# Altium schematic sheet base.SchDoc
size A4; SheetNumber: 1; SheetTotal: 1
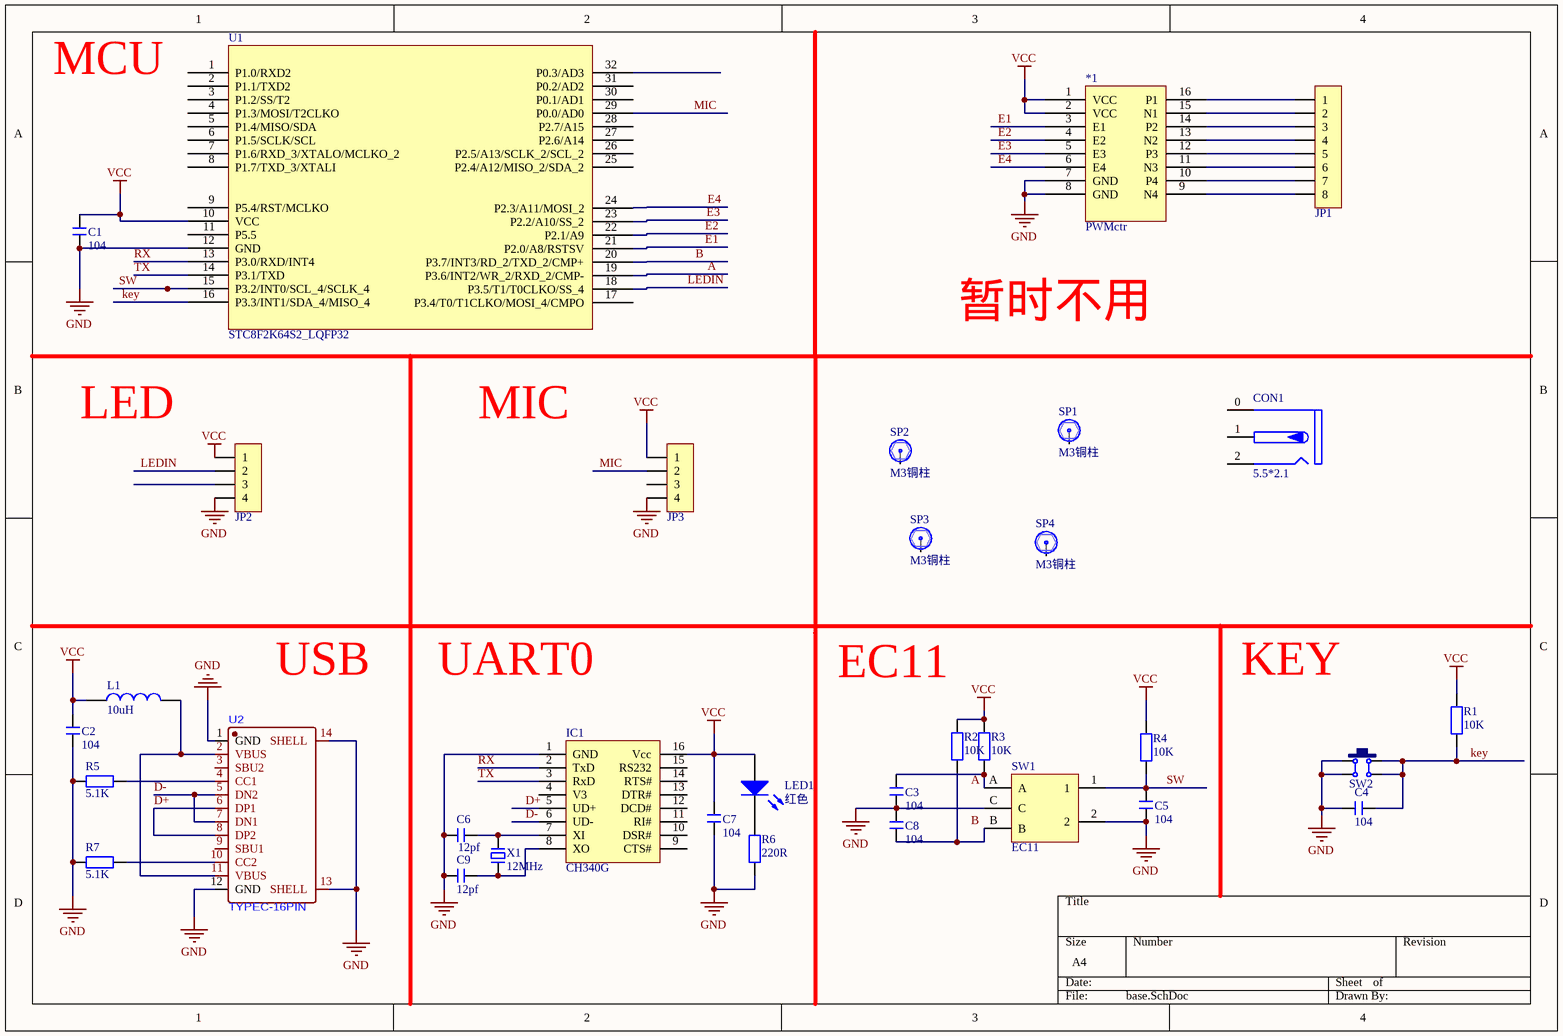
[diagram p0: base.SchDoc]

## Parts
*1  PWMctr  [PWMctr]
C1  104  [C 0805_L]
C2  104  [C 0805_L]
C3  104  [C 0805_L]
C4  104  [C 0805_L]
C5  104  [C 0805_L]
C6  12pf  [C 0805_L]
C7  104  [C 0805_L]
C8  104  [C 0805_L]
C9  12pf  [C 0805_L]
CON1  5.5*2.1  [DC-005P]
IC1  CH340G  [SOP16_L]
JP1  HDR-1X8  [XH2.54-WI-8P]  (value not drawn)
JP2  HDR-1X4  [XH2.54-WI-4P]  (value not drawn)
JP3  HDR-1X4  [XH2.54-WI-4P]  (value not drawn)
L1  10uH  [L 1206]
LED1  红色  [LED 3MM-B]
R1  10K  [R 0805_L]
R2  10K  [R 0805_L]
R3  10K  [R 0805_L]
R4  10K  [R 0805_L]
R5  5.1K  [R 0805_L]
R6  220R  [R 0805_L]
R7  5.1K  [R 0805_L]
SP1  M3铜柱  [M3x4+6_N]
SP2  M3铜柱  [M3x4+6_N]
SP3  M3铜柱  [M3x4+6_N]
SP4  M3铜柱  [M3x4+6_N]
SW1  EC11  [EC11]
SW2  12x12x5  [TSW DIP-12*12*12]  (value not drawn)
U1  STC8F2K64S2_LQFP32  [MCU]
U2  TYPEC-16PIN  [USB-C-16pin]
X1  12MHz  [OSC HC-49S]

## Nets
GND: *1.7(GND) *1.8(GND) C1.1 C2.1 C3.2 C4.1 C5.2 C6.2 C7.2 C8.1 C9.2 IC1.1(GND) JP2.4 JP3.4 R5.2 R6.2 R7.2 SW1.2 SW1.C SW2.1 SW2.4 U1.12(GND) U2.1(GND) U2.12(GND) U2.13(SHELL) U2.14(SHELL)
VCC: *1.1(VCC) *1.2(VCC) C1.2 C2.2 C7.1 IC1.16(Vcc) JP2.1 JP3.1 L1.1 LED1.1(A) R1.1 R2.1 R3.1 R4.1 U1.10(VCC)
A: U1.19(P3.6/INT2/WR_2/RXD_2/CMP-)
B: U1.20(P3.7/INT3/RD_2/TXD_2/CMP+)
D+: IC1.5(UD+) U2.6(DP1) U2.8(DP2)
D-: IC1.6(UD-) U2.5(DN2) U2.7(DN1)
E1: *1.3(E1) U1.21(P2.0/A8/RSTSV)
E2: *1.4(E2) U1.22(P2.1/A9)
E3: *1.5(E3) U1.23(P2.2/A10/SS_2)
E4: *1.6(E4) U1.24(P2.3/A11/MOSI_2)
key: C4.2 R1.2 SW2.2 SW2.3 U1.16(P3.3/INT1/SDA_4/MISO_4)
LEDIN: JP2.2 U1.18(P3.5/T1/T0CLKO/SS_4)
MIC: JP3.2 U1.29(P0.0/AD0)
RX: IC1.2(TxD) U1.13(P3.0/RXD/INT4)
SW: C5.1 R4.2 SW1.1 U1.15(P3.2/INT0/SCL_4/SCLK_4)
TX: IC1.3(RxD) U1.14(P3.1/TXD)
Net*1_9: *1.9(N4) JP1.8
Net*1_10: *1.10(P4) JP1.7
Net*1_11: *1.11(N3) JP1.6
Net*1_12: *1.12(P3) JP1.5
Net*1_13: *1.13(N2) JP1.4
Net*1_14: *1.14(P2) JP1.3
Net*1_15: *1.15(N1) JP1.2
Net*1_16: *1.16(P1) JP1.1
NetC3_1: C3.1 R3.2 SW1.A
NetC6_1: C6.1 IC1.7(XI) X1.1
NetC8_2: C8.2 R2.2 SW1.B
NetC9_1: C9.1 IC1.8(XO) X1.2
NetL1_2: L1.2 U2.2(VBUS) U2.11(VBUS)
NetLED1_2: LED1.2(K) R6.1
NetR5_1: R5.1 U2.4(CC1)
NetR7_1: R7.1 U2.10(CC2)

Not connected (* = marked no-connect by the designer): CON1 0 1 2; IC1 4(V3) 9(CTS#) 10(DSR#) 11(RI#) 12(DCD#) 13(DTR#) 14(RTS#) 15(RS232); JP2 3; JP3 3; SP1 1; SP2 1; SP3 1; SP4 1; U1 1(P1.0/RXD2) 2(P1.1/TXD2) 3(P1.2/SS/T2) 4(P1.3/MOSI/T2CLKO) 5(P1.4/MISO/SDA) 6(P1.5/SCLK/SCL) 7(P1.6/RXD_3/XTALO/MCLKO_2) 8(P1.7/TXD_3/XTALI) 9(P5.4/RST/MCLKO) 11(P5.5) 17(P3.4/T0/T1CLKO/MOSI_4/CMPO) 25(P2.4/A12/MISO_2/SDA_2) 26(P2.5/A13/SCLK_2/SCL_2) 27(P2.6/A14) 28(P2.7/A15) 30(P0.1/AD1) 31(P0.2/AD2) 32(P0.3/AD3); U2 3(SBU2) 9(SBU1)

## Notes on the sheet
- MCU
- 暂时不用
- LED
- MIC
- USB
- UART0
- EC11
- KEY
- Labels drawn without touching a wire or pin: A, B

## Library data of the parts
*1 = PWMctr: PWM控制板
C1-C9 = C: 贴片电容; BOM名称: 无极性贴片电容; 淘宝ID: 封装库来自淘宝 ID：黄晶宝石; 联系售后，技术支持: https://shop463601444.taobao.com; 唯一出售店铺网址: https://shop463601444.taobao.com
CON1 = DC-005P: 带屏蔽DC电源接口; BOM名称: 带屏蔽DC电源接口; 学习资源: https://shop463601444.taobao.com
IC1 = CH340G: 串口转USB; 版权归属: 封装库来自淘宝 ID：黄晶宝石; BOM名称: 串口转USB; 学习资源: https://shop463601444.taobao.com
JP1 = Header 8: 8P接插件; 版权归属: 封装库来自淘宝 ID：黄晶宝石; BOM名称: 8P接插件; 学习资源: https://shop463601444.taobao.com
JP2 JP3 = Header 4: 4P接插件; 版权归属: 封装库来自淘宝 ID：黄晶宝石; BOM名称: 4P接插件; 学习资源: https://shop463601444.taobao.com
L1 = L: 小功率贴片电感; 淘宝ID: 封装库来自淘宝 ID：黄晶宝石; 封装库来自淘宝卖家 ID：黄晶宝石: 其他店铺购入均为盗版，不享受售后技术支持服务，请立即申请退款; BOM名称: 小功率贴片电感; 联系售后: https://shop463601444.taobao.com
LED1 = LED-3MM: 直插3mm LED; BOM名称: 插件LED; 版权归属: 封装库来自淘宝 ID：黄晶宝石; 联系售后: https://shop463601444.taobao.com
R1-R7 = R: 贴片电阻; 版权归属: 来自淘宝 ID：黄晶宝石; 封装库来自淘宝卖家 ID：黄晶宝石: 其他店铺购入均为盗版，不享受售后技术支持服务，请立即申请退款; BOM名称: 贴片电阻; 联系售后: https://shop463601444.taobao.com
SP1-SP4 = 铜柱加头大焊盘: 铜柱; 版权归属: 封装库来自淘宝 ID：黄晶宝石; BOM名称: 铜柱; 学习资源: https://shop463601444.taobao.com
SW1 = EC11: 数字开关编码器; BOM名称: 数字编码开关; 版权归属: 封装库来自淘宝 ID：黄晶宝石; 封装库来自淘宝卖家 ID：黄晶宝石: 其他店铺购入均为盗版，不享受售后技术支持服务，请立即申请退款; 技术支持，联系售后: https://shop463601444.taobao.com
SW2 = TSW DIP-12x12: 直插12x12轻触开关; 版权归属: 封装库来自淘宝 ID：黄晶宝石; BOM名称: 直插12x12轻触开关; 唯一出售店铺网址: https://shop463601444.taobao.com
U1 = MCU
X1 = XTAL-2P: 2脚无源脚晶振; 版权归属: 封装库来自淘宝卖家 ID：黄晶宝石; BOM名称: 2脚无源脚晶振; 学习资源: https://shop463601444.taobao.com